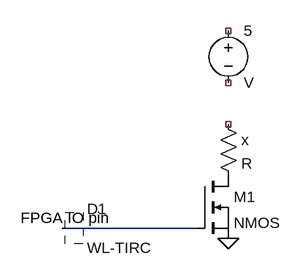
[diagram p0: schematic Driving_Ciruit.asc]
Driving_Ciruit.asc, the LTspice schematic file:
Version 4.1
SHEET 1 880 680
WIRE 16 336 -192 336
FLAG 64 352 0
SYMBOL voltage 64 16 R0
SYMATTR InstName 5
SYMBOL Contrib\\Wurth\\Optoelectronics\\IR+UV-LED\\WL-TIRC 64 160 R0
SYMATTR InstName D1
SYMBOL res 48 160 R0
SYMATTR InstName x
SYMBOL nmos 16 256 R0
SYMATTR InstName M1
TEXT -256 320 Left 2 !FPGA IO pin

The netlist it stands for:
* Driving_Ciruit.asc
V§5 NC_01 NC_02 V
* D1: WL-TIRC (symbol Contrib\Wurth\Optoelectronics\IR+UV-LED\WL-TIRC not available, pin order unknown); nets seen at it: N001
R§x NC_03 P001 R
M1 P001 N001 0 0 NMOS
.model NMOS NMOS
.model PMOS PMOS
.lib standard.mos
FPGA IO pin
.backanno
.end